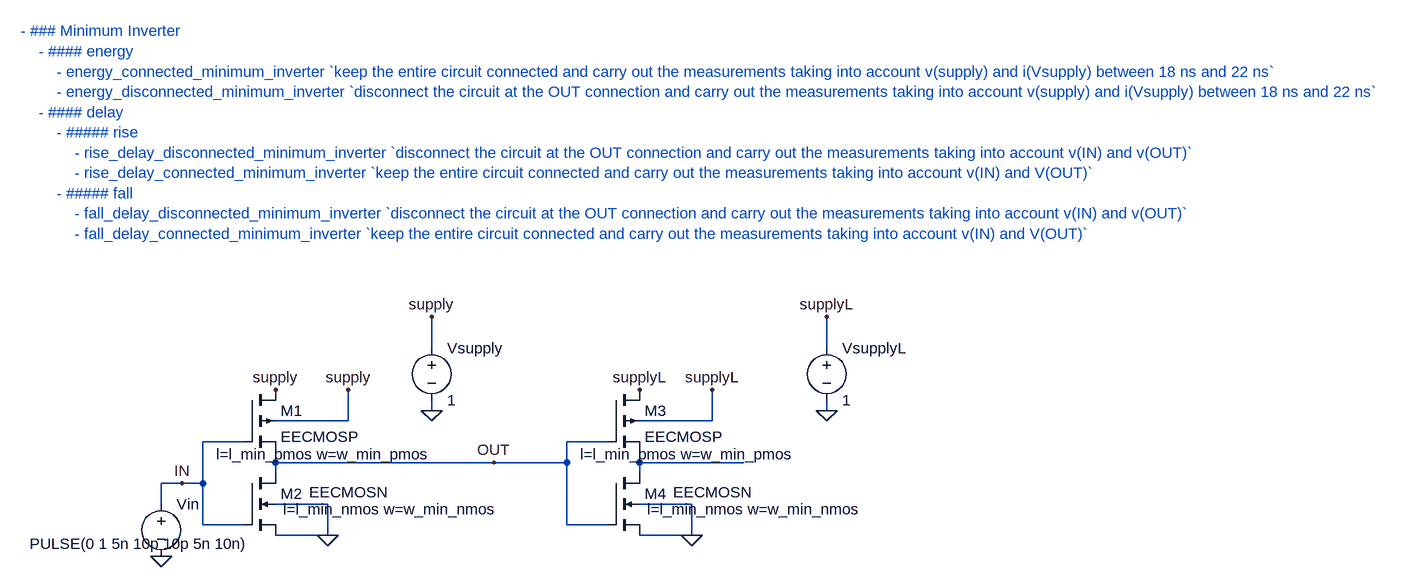
[diagram p0: schematic minimum_inverter_connected.asc]
minimum_inverter_connected.asc, the LTspice schematic file:
Version 4
SHEET 1 2136 680
WIRE 464 16 464 -32
WIRE 1072 16 1072 -32
WIRE 464 112 464 96
WIRE 1072 112 1072 96
WIRE 336 128 336 80
WIRE 336 128 224 128
WIRE 896 128 896 80
WIRE 896 128 784 128
WIRE 176 160 112 160
WIRE 736 160 672 160
WIRE 224 192 224 176
WIRE 560 192 224 192
WIRE 672 192 672 160
WIRE 672 192 560 192
WIRE 784 192 784 176
WIRE 944 192 784 192
WIRE 224 208 224 192
WIRE 784 208 784 192
WIRE 80 224 48 224
WIRE 112 224 112 160
WIRE 112 224 80 224
WIRE 48 256 48 224
WIRE 304 256 224 256
WIRE 864 256 784 256
WIRE 112 288 112 224
WIRE 176 288 112 288
WIRE 672 288 672 192
WIRE 736 288 672 288
WIRE 304 304 304 256
WIRE 304 304 224 304
WIRE 864 304 864 256
WIRE 864 304 784 304
FLAG 48 336 0
FLAG 304 304 0
FLAG 80 224 IN
FLAG 560 192 OUT
FLAG 464 -32 supply
FLAG 1072 112 0
FLAG 864 304 0
FLAG 464 112 0
FLAG 1072 -32 supplyL
FLAG 224 80 supply
FLAG 336 80 supply
FLAG 784 80 supplyL
FLAG 896 80 supplyL
SYMBOL pmos4 176 80 R0
WINDOW 123 -43 99 Left 2
SYMATTR Value2 l=l_min_pmos w=w_min_pmos
SYMATTR InstName M1
SYMATTR Value EECMOSP
SYMBOL nmos4 176 208 R0
WINDOW 3 100 30 Left 2
WINDOW 123 60 56 Left 2
SYMATTR Value EECMOSN
SYMATTR Value2 l=l_min_nmos w=w_min_nmos
SYMATTR InstName M2
SYMBOL voltage 464 0 R0
WINDOW 123 0 0 Left 0
WINDOW 39 0 0 Left 0
SYMATTR InstName Vsupply
SYMATTR Value 1
SYMBOL voltage 48 240 R0
WINDOW 3 -202 77 Left 2
WINDOW 123 0 0 Left 0
WINDOW 39 0 0 Left 0
SYMATTR Value PULSE(0 1 5n 10p 10p 5n 10n)
SYMATTR InstName Vin
SYMBOL pmos4 736 80 R0
WINDOW 123 -43 99 Left 2
SYMATTR Value2 l=l_min_pmos w=w_min_pmos
SYMATTR InstName M3
SYMATTR Value EECMOSP
SYMBOL nmos4 736 208 R0
WINDOW 3 100 30 Left 2
WINDOW 123 60 56 Left 2
SYMATTR Value EECMOSN
SYMATTR Value2 l=l_min_nmos w=w_min_nmos
SYMATTR InstName M4
SYMBOL voltage 1072 0 R0
WINDOW 123 0 0 Left 0
WINDOW 39 0 0 Left 0
SYMATTR InstName VsupplyL
SYMATTR Value 1
TEXT -168 -472 Left 2 ;- ### Minimum Inverter\n    - #### energy\n        - energy_connected_minimum_inverter `keep the entire circuit connected and carry out the measurements taking into account v(supply) and i(Vsupply) between 18 ns and 22 ns`\n        - energy_disconnected_minimum_inverter `disconnect the circuit at the OUT connection and carry out the measurements taking into account v(supply) and i(Vsupply) between 18 ns and 22 ns`\n    - #### delay\n        - ##### rise\n            - rise_delay_disconnected_minimum_inverter `disconnect the circuit at the OUT connection and carry out the measurements taking into account v(IN) and v(OUT)`\n            - rise_delay_connected_minimum_inverter `keep the entire circuit connected and carry out the measurements taking into account v(IN) and V(OUT)`\n        - ##### fall\n            - fall_delay_disconnected_minimum_inverter `disconnect the circuit at the OUT connection and carry out the measurements taking into account v(IN) and v(OUT)`\n            - fall_delay_connected_minimum_inverter `keep the entire circuit connected and carry out the measurements taking into account v(IN) and V(OUT)`

The netlist it stands for:
* minimum_inverter_connected.asc
M1 supply IN OUT supply EECMOSP l=l_min_pmos w=w_min_pmos
M2 OUT IN 0 0 EECMOSN l=l_min_nmos w=w_min_nmos
Vsupply supply 0 1
Vin IN 0 PULSE(0 1 5n 10p 10p 5n 10n)
M3 supplyL OUT N001 supplyL EECMOSP l=l_min_pmos w=w_min_pmos
M4 N001 OUT 0 0 EECMOSN l=l_min_nmos w=w_min_nmos
VsupplyL supplyL 0 1
.model NMOS NMOS
.model PMOS PMOS
.lib standard.mos
* - ### Minimum Inverter
*     - #### energy
*         - energy_connected_minimum_inverter `keep the entire circuit connected and carry out the measurements taking into account v(supply) and i(Vsupply) between 18 ns and 22 ns`
*         - energy_disconnected_minimum_inverter `disconnect the circuit at the OUT connection and carry out the measurements taking into account v(supply) and i(Vsupply) between 18 ns and 22 ns`
*     - #### delay
*         - ##### rise
*             - rise_delay_disconnected_minimum_inverter `disconnect the circuit at the OUT connection and carry out the measurements taking into account v(IN) and v(OUT)`
*             - rise_delay_connected_minimum_inverter `keep the entire circuit connected and carry out the measurements taking into account v(IN) and V(OUT)`
*         - ##### fall
*             - fall_delay_disconnected_minimum_inverter `disconnect the circuit at the OUT connection and carry out the measurements taking into account v(IN) and v(OUT)`
*             - fall_delay_connected_minimum_inverter `keep the entire circuit connected and carry out the measurements taking into account v(IN) and V(OUT)`
.backanno
.end